# Altium schematic sheet main.SchDoc
size A4; SheetNumber: 1; SheetTotal: 3
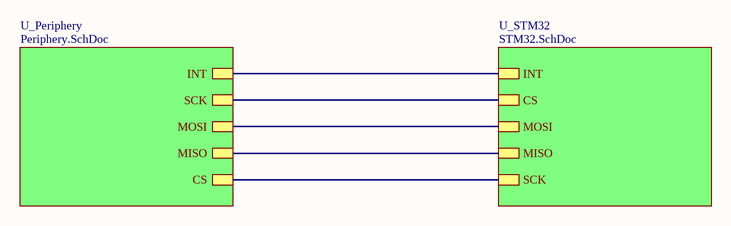
[diagram p0: main.SchDoc]

## Sub-sheets
U_Periphery = Periphery.SchDoc: CS, MISO, MOSI, SCK, INT
U_STM32 = STM32.SchDoc: SCK, MISO, MOSI, CS, INT

## Nets
(unnamed): sheet U_STM32/SCK, sheet U_Periphery/CS
(unnamed): sheet U_STM32/MISO, sheet U_Periphery/MISO
(unnamed): sheet U_STM32/MOSI, sheet U_Periphery/MOSI
(unnamed): sheet U_STM32/CS, sheet U_Periphery/SCK
(unnamed): sheet U_STM32/INT, sheet U_Periphery/INT